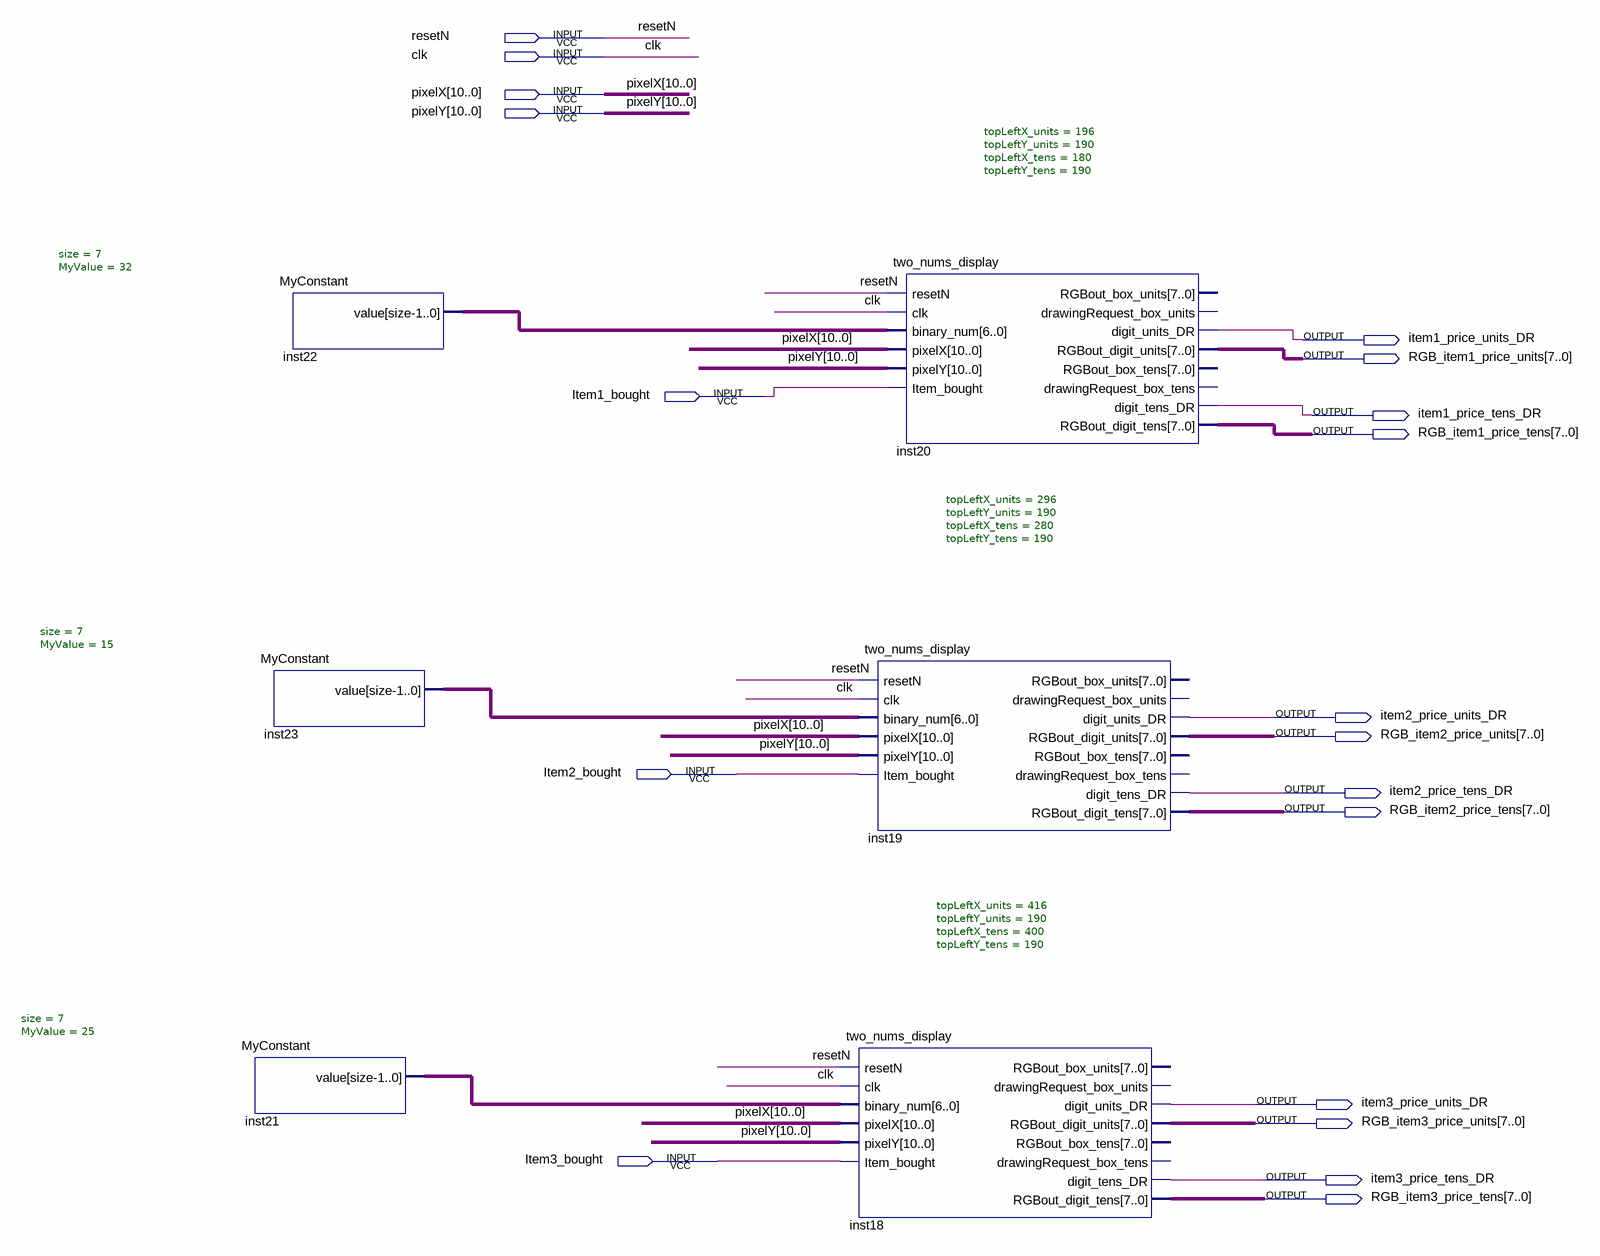
[diagram p0: schematic sheet]
// Quartus schematic prices_display.bdf as structural Verilog: 6 symbols, 19 pins
module prices_display (
  input  resetN,
  input  clk,
  input  [10:0] pixelX,
  input  [10:0] pixelY,
  input  Item1_bought,
  input  Item2_bought,
  input  Item3_bought,
  output item1_price_units_DR,
  output [7:0] RGB_item1_price_units,
  output item1_price_tens_DR,
  output [7:0] RGB_item1_price_tens,
  output item2_price_units_DR,
  output [7:0] RGB_item2_price_units,
  output item2_price_tens_DR,
  output [7:0] RGB_item2_price_tens,
  output item3_price_units_DR,
  output [7:0] RGB_item3_price_units,
  output item3_price_tens_DR,
  output [7:0] RGB_item3_price_tens
);

  wire [6:0] inst21_value, inst22_value, inst23_value;

  MyConstant #(.size(7), .MyValue(32)) inst22 (.value(inst22_value));
  MyConstant #(.size(7), .MyValue(15)) inst23 (.value(inst23_value));
  MyConstant #(.size(7), .MyValue(25)) inst21 (.value(inst21_value));
  two_nums_display #(.topLeftX_units(196), .topLeftY_units(190), .topLeftX_tens(180), .topLeftY_tens(190)) inst20 (
    .resetN(resetN), .clk(clk), .binary_num(inst22_value), .pixelX(pixelX), .pixelY(pixelY),
    .Item_bought(Item1_bought), .digit_units_DR(item1_price_units_DR),
    .RGBout_digit_units(RGB_item1_price_units), .digit_tens_DR(item1_price_tens_DR),
    .RGBout_digit_tens(RGB_item1_price_tens));  // open: RGBout_box_units, drawingRequest_box_units, RGBout_box_tens, drawingRequest_box_tens
  two_nums_display #(.topLeftX_units(296), .topLeftY_units(190), .topLeftX_tens(280), .topLeftY_tens(190)) inst19 (
    .resetN(resetN), .clk(clk), .binary_num(inst23_value), .pixelX(pixelX), .pixelY(pixelY),
    .Item_bought(Item2_bought), .digit_units_DR(item2_price_units_DR),
    .RGBout_digit_units(RGB_item2_price_units), .digit_tens_DR(item2_price_tens_DR),
    .RGBout_digit_tens(RGB_item2_price_tens));  // open: RGBout_box_units, drawingRequest_box_units, RGBout_box_tens, drawingRequest_box_tens
  two_nums_display #(.topLeftX_units(416), .topLeftY_units(190), .topLeftX_tens(400), .topLeftY_tens(190)) inst18 (
    .resetN(resetN), .clk(clk), .binary_num(inst21_value), .pixelX(pixelX), .pixelY(pixelY),
    .Item_bought(Item3_bought), .digit_units_DR(item3_price_units_DR),
    .RGBout_digit_units(RGB_item3_price_units), .digit_tens_DR(item3_price_tens_DR),
    .RGBout_digit_tens(RGB_item3_price_tens));  // open: RGBout_box_units, drawingRequest_box_units, RGBout_box_tens, drawingRequest_box_tens
endmodule
